# Altium project Biocoin_v1.3.PrjPcb
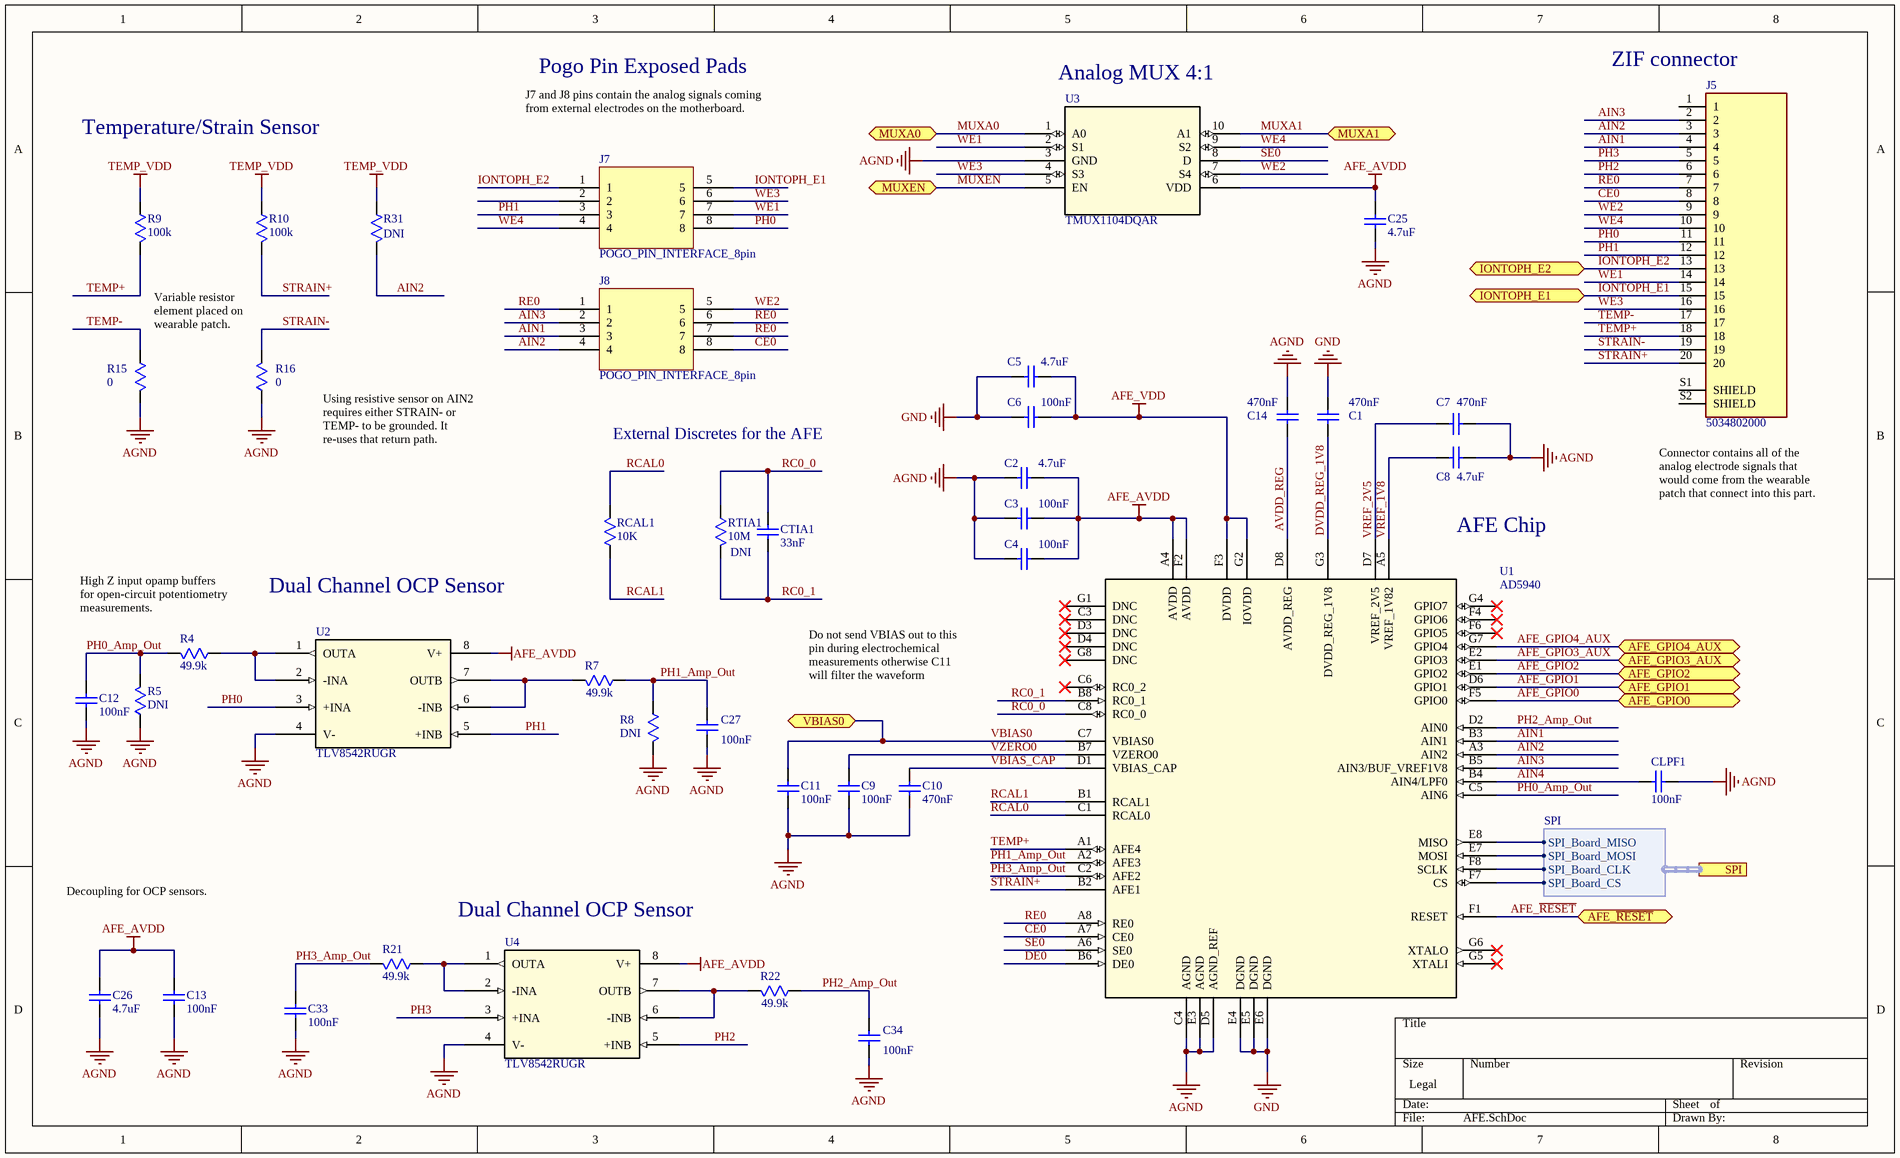
[diagram p0: AFE.SchDoc]
4 sheets, 101 parts. Net scope: flat (ports and power ports of the same name join across sheets).
Board file: Biocoin_v1.3.PcbDoc
Sheets:
  AFE.SchDoc
  MCU_BLE_Module.SchDoc
  Power Management.SchDoc
  Current_Source.SchDoc

## Sheet AFE.SchDoc
size Legal; SheetNumber: 1; SheetTotal: 4

### Parts
C1  value 470nF  [0201 cap]  (hidden comment: CAP)
C2  value 4.7uF  [0201 cap]  (hidden comment: CAP)
C3  value 100nF  [0201 cap]  (hidden comment: CAP)
C4  value 100nF  [0201 cap]  (hidden comment: CAP)
C5  value 4.7uF  [0201 cap]  (hidden comment: CAP)
C6  value 100nF  [0201 cap]  (hidden comment: CAP)
C7  value 470nF  [0201 cap]  (hidden comment: CAP)
C8  value 4.7uF  [0201 cap]  (hidden comment: CAP)
C9  value 100nF  [0402-CAP]  (hidden comment: CAP)
C10  value 470nF  [0201 cap]  (hidden comment: CAP)
C11  value 100nF  [0402-CAP]  (hidden comment: CAP)
C12  value 100nF  [0201 cap]  (hidden comment: CAP)
C13  value 100nF  [0201 cap]  (hidden comment: CAP)
C14  value 470nF  [0201 cap]  (hidden comment: CAP)
C25  value 4.7uF  [0201 cap]  (hidden comment: CAP)
C26  value 4.7uF  [0201 cap]  (hidden comment: CAP)
C27  value 100nF  [0201 cap]  (hidden comment: CAP)
C33  value 100nF  [0201 cap]  (hidden comment: CAP)
C34  value 100nF  [0201 cap]  (hidden comment: CAP)
CLPF1  value 100nF  [0201 cap]  (hidden comment: CAP)
CTIA1  value 33nF  [0402-CAP]  (hidden comment: CAP)
J5  5034802000  [MOLEX_5034802000]
J7  POGO_PIN_INTERFACE_8pin  [POGO_PIN_INTERFACE_8pin]
J8  POGO_PIN_INTERFACE_8pin  [POGO_PIN_INTERFACE_8pin]
R4  value 49.9k  [0201 res]  (hidden comment: RES)
R5  Do Not Install: DNI  [0201 res]  (hidden comment: RES)
R7  value 49.9k  [0201 res]  (hidden comment: RES)
R8  Do Not Install: DNI  [0201 res]  (hidden comment: RES)
R9  value 100k  [0201 res]  (hidden comment: RES)
R10  value 100k  [0201 res]  (hidden comment: RES)
R15  value 0  [0201 res]  (hidden comment: RES)
R16  value 0  [0201 res]  (hidden comment: RES)
R21  value 49.9k  [0201 res]  (hidden comment: RES)
R22  value 49.9k  [0201 res]  (hidden comment: RES)
R31  Do Not Install: DNI  [0201 res]  (hidden comment: RES)
RCAL1  value 10K  [0201 res]  (hidden comment: RES)
RTIA1  value 10M  Do Not Install: DNI  [0402-RES]  (hidden comment: RES)
U1  AD5940  [CB-56-3_ADI]
U2  TLV8542RUGR  [QFN50P150X150X40-8N]
U3  TMUX1104DQAR  [USON_104DQAR_TEX]
U4  TLV8542RUGR  [QFN50P150X150X40-8N]

### Ports
AFE_GPIO0 (bidir), AFE_GPIO1 (bidir), AFE_GPIO2 (bidir), AFE_GPIO3_AUX (bidir), AFE_GPIO4_AUX (bidir), AFE_~{RESET} (bidir), IONTOPH_E1 (bidir), IONTOPH_E2 (bidir), MUXA0 (bidir), MUXA1 (bidir), MUXEN (bidir), SPI (harness SPI), VBIAS0 (bidir)

### Harnesses
SPI: SPI_Board_MISO, SPI_Board_MOSI, SPI_Board_CLK, SPI_Board_CS

### Nets
AFE_AVDD: C2.1 C3.1 C4.1 C13.2 C25.2 C26.2 U1.A4(AVDD) U1.F2(AVDD) U2.8(V+) U3.6(VDD) U4.8(V+)
AFE_VDD: C5.1 C6.1 U1.F3(DVDD) U1.G2(IOVDD)
AGND: C2.2 C3.2 C4.2 C7.1 C8.1 C9.1 C10.1 C11.1 C12.2 C13.1 C14.1 C25.1 C26.1 C27.2 C33.2 C34.2 CLPF1.2 R5.2 R8.2 R15.2 R16.2 U1.C4(AGND) U1.D5(AGND_REF) U1.E3(AGND) U2.4(V-) U3.3(GND) U4.4(V-)
GND: C1.1 C5.2 C6.2 U1.E4(DGND) U1.E5(DGND) U1.E6(DGND)
TEMP_VDD: R9.1 R10.1 R31.1
AFE_GPIO0: U1.F5(GPIO0) ; port AFE_GPIO0
AFE_GPIO1: U1.D6(GPIO1) ; port AFE_GPIO1
AFE_GPIO2: U1.E1(GPIO2) ; port AFE_GPIO2
AFE_GPIO3_AUX: U1.E2(GPIO3) ; port AFE_GPIO3_AUX
AFE_GPIO4_AUX: U1.G7(GPIO4) ; port AFE_GPIO4_AUX
AFE_~{RESET}: U1.F1(RESET) ; port AFE_~{RESET}
AIN1: J5.4 J8.3 U1.B3(AIN1)
AIN2: J5.3 J8.4 R31.2 U1.A3(AIN2)
AIN3: J5.2 J8.2 U1.B5(AIN3/BUF_VREF1V8)
AIN4: CLPF1.1 U1.B4(AIN4/LPF0)
AVDD_REG: C14.2 U1.D8(AVDD_REG)
CE0: J5.8 J8.8 U1.A7(CE0)
DE0: U1.B6(DE0)
DVDD_REG_1V8: C1.2 U1.G3(DVDD_REG_1V8)
IONTOPH_E1: J5.15 J7.5 ; port IONTOPH_E1
IONTOPH_E2: J5.13 J7.1 ; port IONTOPH_E2
MUXA0: U3.1(A0) ; port MUXA0
MUXA1: U3.10(A1) ; port MUXA1
MUXEN: U3.5(EN) ; port MUXEN
PH0: J5.11 J7.8 U2.3(+INA)
PH0_Amp_Out: C12.1 R4.1 R5.1 U1.C5(AIN6)
PH1: J5.12 J7.3 U2.5(+INB)
PH1_Amp_Out: C27.1 R7.1 R8.1 U1.A2(AFE3)
PH2: J5.6 U4.5(+INB)
PH2_Amp_Out: C34.1 R22.1 U1.D2(AIN0)
PH3: J5.5 U4.3(+INA)
PH3_Amp_Out: C33.1 R21.1 U1.C2(AFE2)
RC0_0: CTIA1.1 RTIA1.1 U1.C8(RC0_0)
RC0_1: CTIA1.2 RTIA1.2 U1.B8(RC0_1)
RCAL0: RCAL1.2 U1.C1(RCAL0)
RCAL1: RCAL1.1 U1.B1(RCAL1)
RE0: J5.7 J8.1 J8.6 J8.7 U1.A8(RE0)
SE0: U1.A6(SE0) U3.8(D)
SPI_Board_CLK: U1.F8(SCLK) ; port SPI.SPI_Board_CLK
SPI_Board_CS: U1.F7(CS) ; port SPI.SPI_Board_CS
SPI_Board_MISO: U1.E8(MISO) ; port SPI.SPI_Board_MISO
SPI_Board_MOSI: U1.E7(MOSI) ; port SPI.SPI_Board_MOSI
STRAIN+: J5.20 R10.2 U1.B2(AFE1)
STRAIN-: J5.19 R16.1
TEMP+: J5.18 R9.2 U1.A1(AFE4)
TEMP-: J5.17 R15.1
VBIAS0: C11.2 U1.C7(VBIAS0) ; port VBIAS0
VBIAS_CAP: C10.2 U1.D1(VBIAS_CAP)
VREF_1V8: C8.2 U1.A5(VREF_1V82)
VREF_2V5: C7.2 U1.D7(VREF_2V5)
VZERO0: C9.2 U1.B7(VZERO0)
WE1: J5.14 J7.7 U3.2(S1)
WE2: J5.9 J8.5 U3.7(S4)
WE3: J5.16 J7.6 U3.4(S3)
WE4: J5.10 J7.4 U3.9(S2)
NetR4_2: R4.2 U2.1(OUTA) U2.2(-INA)
NetR7_2: R7.2 U2.6(-INB) U2.7(OUTB)
NetR21_2: R21.2 U4.1(OUTA) U4.2(-INA)
NetR22_2: R22.2 U4.6(-INB) U4.7(OUTB)

Not connected (* = marked no-connect by the designer): J5 1 S1(SHIELD) S2(SHIELD); J7 2; U1 C3(DNC)* C6(RC0_2)* D3(DNC)* D4(DNC)* F4(GPIO6)* F6(GPIO5)* G1(DNC)* G4(GPIO7)* G5(XTALI)* G6(XTALO)* G8(DNC)*

### Notes on the sheet
- Pogo Pin Exposed Pads
- (near U3) Analog MUX 4:1
- (near J5) ZIF connector
- Temperature/Strain Sensor
- J7 and J8 pins contain the analog signals coming from external electrodes on the motherboard.
- Variable resistor element placed on wearable patch.
- Using resistive sensor on AIN2 requires either STRAIN- or TEMP- to be grounded. It re-uses that return path.
- External Discretes for the AFE
- (near J5) Connector contains all of the analog electrode signals that would come from the wearable patch that connect into this part.
- AFE Chip
- (near R4) High Z input opamp buffers for open-circuit potentiometry measurements.
- Dual Channel OCP Sensor
- Do not send VBIAS out to this pin during electrochemical measurements otherwise C11 will filter the waveform
- Decoupling for OCP sensors.

### Library data of the parts
C1-C14 C25-C27 C33 C34 CLPF1 CTIA1 = CAP SMD: Multilayer Chip Capacitor; Designer: OMIGA
J5 = 5034802000: 20 Position FFC, FPC Connector Contacts, Top and Bottom 0.020 (0.50mm) Surface Mount, Right Angle; MP: 503480-2000; MF: Molex; Check_prices: https://www.snapeda.com/parts/503480-2000/Molex/view-part/?ref=eda; Value: *; Availability: In Stock; Price: None; Package: None; SnapEDA_Link: https://www.snapeda.com/parts/503480-2000/Molex/view-part/?ref=snap; Purchase-URL: https://pricing.snapeda.com/search/part/503480-2000/?ref=eda
R4 R5 R7-R10 R15 R16 R21 R22 RTIA1 = RES SMD: Surface Mount Resistor; Designer: OMIGA
R31 = RES SMD: Surface Mount Resistor; Designer: OMIGA; Value: 100k
RCAL1 = RES 0201: Surface Mount Resistor; Designer: OMIGA
U1 = AD5940: High Precision, Impedance, and / Electrochemical Front End
U2 U4 = TLV8542RUGR: Low power, tiny, low input bias current opamp; Mfr_Name: Texas Instruments; RefDes: RefDes; Type: Type
U3 = TMUX1104DQAR_1: No Description Available; Mfr_Name: Texas Instruments; Copyright: Copyright (C) 2022 Ultra Librarian. All rights reserved.; Manufacturer_Part_Number: TMUX1104DQAR; Digi-Key_Part_Number_1: 296-TMUX1104DQARTR-ND; Digi-Key_Part_Number_2: 296-TMUX1104DQARCT-ND; Digi-Key_Part_Number_3: 296-TMUX1104DQARDKR-ND; RefDes: RefDes; Type: DEV

## Sheet MCU_BLE_Module.SchDoc
size Legal; SheetNumber: 2; SheetTotal: 4
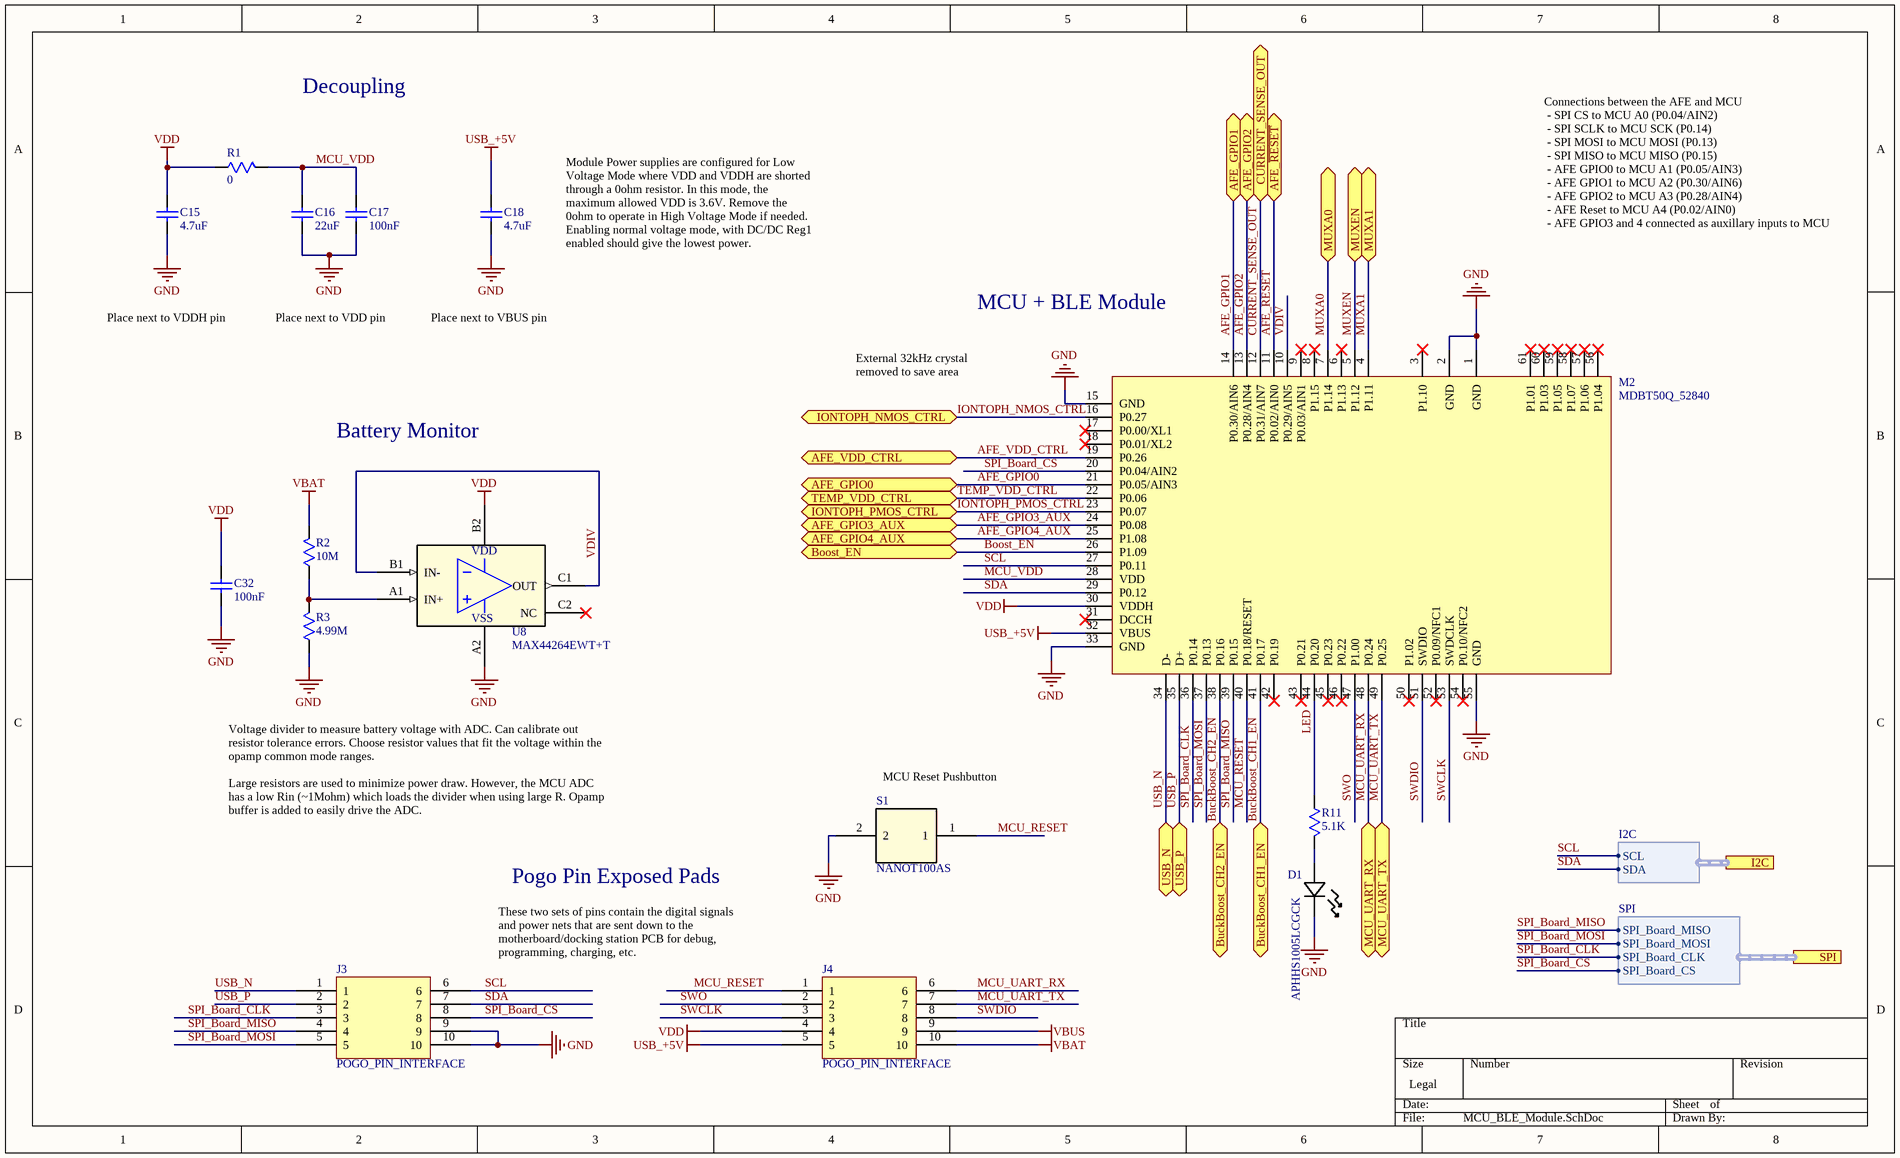
[diagram p1: MCU_BLE_Module.SchDoc]

### Parts
C15  value 4.7uF  [0201 cap]  (hidden comment: CAP)
C16  value 22uF  [0402-CAP]  (hidden comment: CAP)
C17  value 100nF  [0201 cap]  (hidden comment: CAP)
C18  value 4.7uF  [0201 cap]  (hidden comment: CAP)
C32  value 100nF  [0201 cap]  (hidden comment: CAP)
D1  APHHS1005LCGCK  [0402-LED]
J3  POGO_PIN_INTERFACE  [POGO_PIN_INTERFACE_10pin]
J4  POGO_PIN_INTERFACE  [POGO_PIN_INTERFACE_10pin]
M2  MDBT50Q_52840  [MDBT50Q]
R1  value 0  [0201 res]  (hidden comment: RES)
R2  value 10M  [0402-RES]  (hidden comment: RES)
R3  value 4.99M  [0402-RES]  (hidden comment: RES)
R11  value 5.1K  [0201 res]  (hidden comment: RES)
S1  NANOT100AS  [NANOT100AS_CNK-M]
U8  MAX44264EWT+T  [21-0217D_W61B1-1_MXM]

### Ports
AFE_GPIO0 (bidir), AFE_GPIO1 (bidir), AFE_GPIO2 (bidir), AFE_GPIO3_AUX (bidir), AFE_GPIO4_AUX (bidir), AFE_VDD_CTRL (bidir), AFE_~{RESET} (bidir), Boost_EN (bidir), BuckBoost_CH1_EN (bidir), BuckBoost_CH2_EN (bidir), CURRENT_SENSE_OUT (bidir), I2C (harness I2C), IONTOPH_NMOS_CTRL (bidir), IONTOPH_PMOS_CTRL (bidir), MCU_UART_RX (bidir), MCU_UART_TX (bidir), MUXA0 (bidir), MUXA1 (bidir), MUXEN (bidir), SPI (harness SPI), TEMP_VDD_CTRL (bidir), USB_N (bidir), USB_P (bidir)

### Harnesses
SPI: SPI_Board_MISO, SPI_Board_MOSI, SPI_Board_CLK, SPI_Board_CS
I2C: SCL, SDA

### Nets
GND: C15.2 C16.2 C17.2 C18.2 C32.2 D1.1 J3.9 J3.10 M2.1(GND) M2.2(GND) M2.15(GND) M2.33(GND) M2.55(GND) R3.1 S1.2 U8.A2(VSS)
USB_+5V: C18.1 J4.5 M2.32(VBUS)
VBAT: J4.10 R2.2
VBUS: J4.9
VDD: C15.1 C32.1 J4.4 M2.30(VDDH) R1.1 U8.B2(VDD)
AFE_GPIO0: M2.21(P0.05/AIN3) ; port AFE_GPIO0
AFE_GPIO1: M2.14(P0.30/AIN6) ; port AFE_GPIO1
AFE_GPIO2: M2.13(P0.28/AIN4) ; port AFE_GPIO2
AFE_GPIO3_AUX: M2.24(P0.08) ; port AFE_GPIO3_AUX
AFE_GPIO4_AUX: M2.25(P1.08) ; port AFE_GPIO4_AUX
AFE_~{RESET}: M2.11(P0.02/AIN0) ; port AFE_~{RESET}
AFE_VDD_CTRL: M2.19(P0.26) ; port AFE_VDD_CTRL
Boost_EN: M2.26(P1.09) ; port Boost_EN
BuckBoost_CH1_EN: M2.41(P0.17) ; port BuckBoost_CH1_EN
BuckBoost_CH2_EN: M2.38(P0.16) ; port BuckBoost_CH2_EN
CURRENT_SENSE_OUT: M2.12(P0.31/AIN7) ; port CURRENT_SENSE_OUT
IONTOPH_NMOS_CTRL: M2.16(P0.27) ; port IONTOPH_NMOS_CTRL
IONTOPH_PMOS_CTRL: M2.23(P0.07) ; port IONTOPH_PMOS_CTRL
LED: M2.44(P0.20) R11.1
MCU_RESET: J4.1 M2.40(P0.18/RESET) S1.1
MCU_UART_RX: J4.6 M2.48(P0.24) ; port MCU_UART_RX
MCU_UART_TX: J4.7 M2.49(P0.25) ; port MCU_UART_TX
MCU_VDD: C16.1 C17.1 M2.28(VDD) R1.2
MUXA0: M2.7(P1.14) ; port MUXA0
MUXA1: M2.4(P1.11) ; port MUXA1
MUXEN: M2.5(P1.12) ; port MUXEN
SCL: J3.6 M2.27(P0.11) ; port I2C.SCL
SDA: J3.7 M2.29(P0.12) ; port I2C.SDA
SPI_Board_CLK: J3.3 M2.36(P0.14) ; port SPI.SPI_Board_CLK
SPI_Board_CS: J3.8 M2.20(P0.04/AIN2) ; port SPI.SPI_Board_CS
SPI_Board_MISO: J3.4 M2.39(P0.15) ; port SPI.SPI_Board_MISO
SPI_Board_MOSI: J3.5 M2.37(P0.13) ; port SPI.SPI_Board_MOSI
SWCLK: J4.3 M2.53(SWDCLK)
SWDIO: J4.8 M2.51(SWDIO)
SWO: J4.2 M2.47(P1.00)
TEMP_VDD_CTRL: M2.22(P0.06) ; port TEMP_VDD_CTRL
USB_N: J3.1 M2.34(D-) ; port USB_N
USB_P: J3.2 M2.35(D+) ; port USB_P
VDIV: M2.10(P0.29/AIN5) U8.B1(IN-) U8.C1(OUT)
NetD1_2: D1.2 R11.2
NetR2_1: R2.1 R3.2 U8.A1(IN+)

Not connected (* = marked no-connect by the designer): M2 3(P1.10)* 6(P1.13)* 8(P1.15)* 9(P0.03/AIN1)* 17(P0.00/XL1)* 18(P0.01/XL2)* 31(DCCH)* 42(P0.19)* 43(P0.21)* 45(P0.23)* 46(P0.22)* 50(P1.02)* 52(P0.09/NFC1)* 54(P0.10/NFC2)* 56(P1.04)* 57(P1.06)* 58(P1.07)* 59(P1.05)* 60(P1.03)* 61(P1.01)*; U8 C2(NC)*

### Notes on the sheet
- Decoupling
- Connections between the AFE and MCU
  - SPI CS to MCU A0 (P0.04/AIN2)
  - SPI SCLK to MCU SCK (P0.14)
  - SPI MOSI to MCU MOSI (P0.13)
  - SPI MISO to MCU MISO (P0.15)
  - AFE GPIO0 to MCU A1 (P0.05/AIN3)
  - AFE GPIO1 to MCU A2 (P0.30/AIN6)
  - AFE GPIO2 to MCU A3 (P0.28/AIN4)
  - AFE Reset to MCU A4 (P0.02/AIN0)
  - AFE GPIO3 and 4 connected as auxillary inputs to MCU
- Module Power supplies are configured for Low Voltage Mode where VDD and VDDH are shorted through a 0ohm resistor. In this mode, the maximum allowed VDD is 3.6V. Remove the 0ohm to operate in High Voltage Mode if needed. Enabling normal voltage mode, with DC/DC Reg1 enabled should give the lowest power.
- Place next to VDDH pin
- Place next to VDD pin
- Place next to VBUS pin
- MCU + BLE Module
- External 32kHz crystal removed to save area
- Battery Monitor
- Voltage divider to measure battery voltage with ADC. Can calibrate out resistor tolerance errors. Choose resistor values that fit the voltage within the opamp common mode ranges.
  Large resistors are used to minimize power draw. However, the MCU ADC has a low Rin (~1Mohm) which loads the divider when using large R. Opamp buffer is added to easily drive the ADC.
- (near S1) MCU Reset Pushbutton
- Pogo Pin Exposed Pads
- These two sets of pins contain the digital signals and power nets that are sent down to the motherboard/docking station PCB for debug, programming, charging, etc.

### Library data of the parts
C15-C18 C32 = CAP SMD: as C1 on sheet AFE
D1 = APHHS1005LCGCK: Green LED 0402; Mfr_Name: Kingbright; Type: DEV; Copyright: Copyright (C) 2022 Ultra Librarian. All rights reserved.; Manufacturer_Part_Number: APHHS1005LCGCK; RefDes: RefDes
R1-R3 R11 = RES SMD: Surface Mount Resistor; Designer: OMIGA
S1 = NANOT100AS: Smallest Push Button Switch; Mfr_Name: C&K; Copyright: Copyright (C) 2022 Ultra Librarian. All rights reserved.; Manufacturer_Part_Number: NANOT100AS; Digi-Key_Part_Number_1: 108-NANOT100ASTR-ND; Digi-Key_Part_Number_2: 108-NANOT100ASCT-ND; Digi-Key_Part_Number_3: 108-NANOT100ASDKR-ND; RefDes: RefDes; Type: DEV
U8 = MAX44264EWT+T: No Description Available; Mfr_Name: Maxim Integrated Products; Copyright: Copyright (C) 2022 Ultra Librarian. All rights reserved.; Manufacturer_Part_Number: MAX44264EWT+T; RefDes: RefDes; Type: DEV

## Sheet Power Management.SchDoc
size B; SheetNumber: 3; SheetTotal: 4
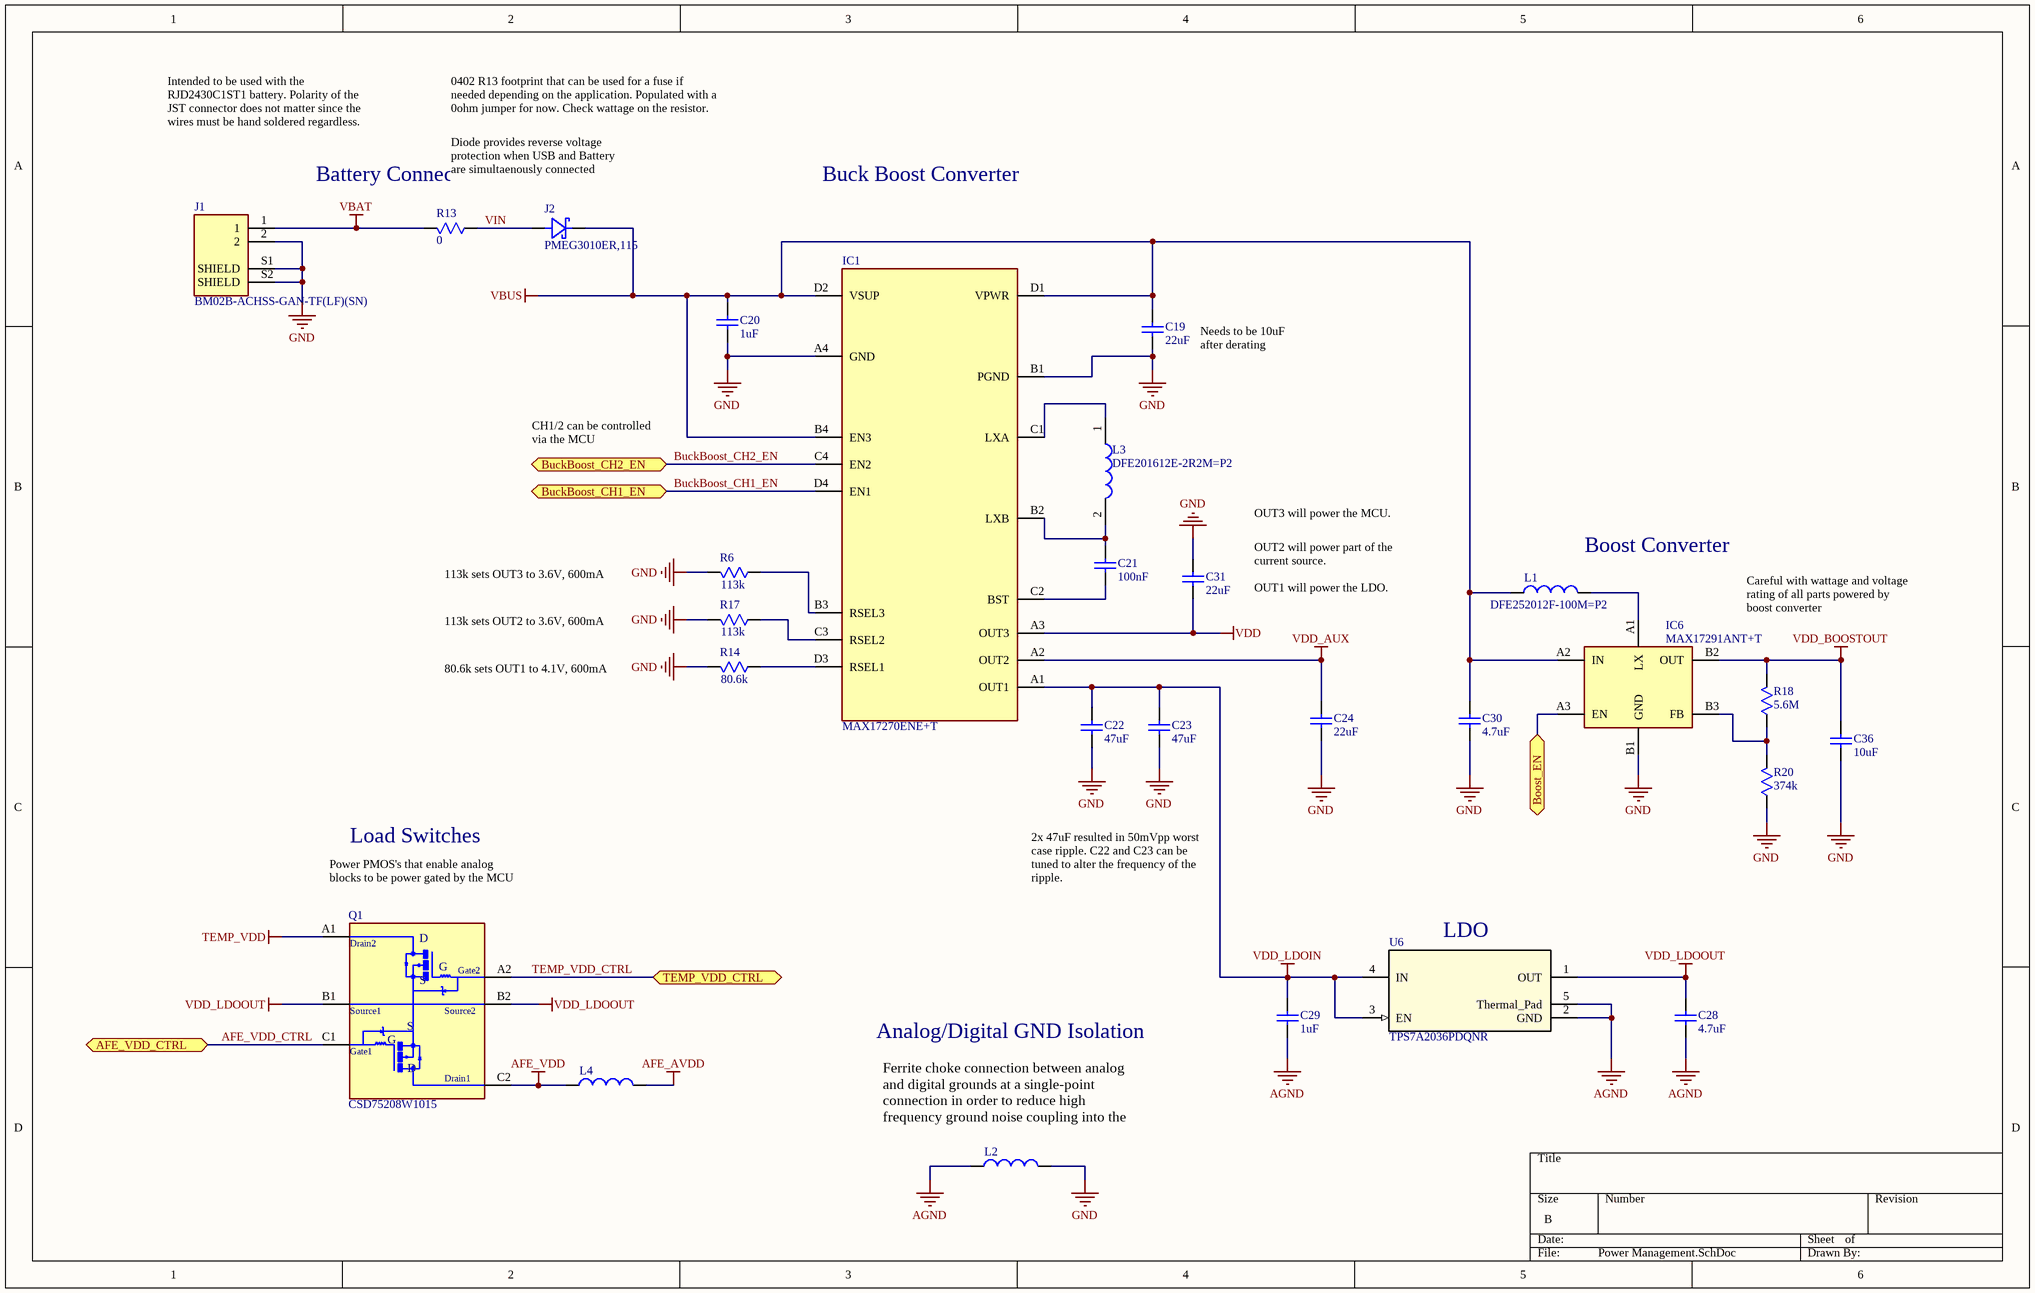
[diagram p2: Power Management.SchDoc]

### Parts
C19  value 22uF  [0402-CAP]  (hidden comment: CAP)
C20  value 1uF  [0201 cap]  (hidden comment: CAP)
C21  value 100nF  [0201 cap]  (hidden comment: CAP)
C22  value 47uF  [0603-CAP]  (hidden comment: CAP)
C23  value 47uF  [0603-CAP]  (hidden comment: CAP)
C24  value 22uF  [0402-CAP]  (hidden comment: CAP)
C28  value 4.7uF  [0201 cap]  (hidden comment: CAP)
C29  value 1uF  [0201 cap]  (hidden comment: CAP)
C30  value 4.7uF  [0201 cap]  (hidden comment: CAP)
C31  value 22uF  [0402-CAP]  (hidden comment: CAP)
C36  value 10uF  [0603-CAP]  (hidden comment: CAP)
IC1  MAX17270ENE+T  [BGA16C40P4X4_177X177X50]
IC6  MAX17291ANT+T  [Maxim_Integrated_N60N1-1_MFG]
J1  BM02B-ACHSS-GAN-TF(LF)(SN)  [JST_BM02B-ACHSS-GAN-TF(LF)(SN)]
J2  PMEG3010ER,115  [SDO_SOD-123FL_ONS-L]
L1  DFE252012F-100M=P2  [INDC2520X120N]
L2  IND  [0201 ferrite]  (value not drawn)
L3  DFE201612E-2R2M=P2  [1286ASH1R0MP2]
L4  IND  [0201 ferrite]  (value not drawn)
Q1  CSD75208W1015  [BGA6C50P2X3_145X95X62]
R6  value 113k  [0201 res]  (hidden comment: RES)
R13  value 0  [0402-RES]  (hidden comment: RES)
R14  value 80.6k  [0201 res]  (hidden comment: RES)
R17  value 113k  [0201 res]  (hidden comment: RES)
R18  value 5.6M  [0201 res]  (hidden comment: RES)
R20  value 374k  [0201 res]  (hidden comment: RES)
U6  TPS7A2036PDQNR  [DQN0004A-MFG]

### Ports
AFE_VDD_CTRL (bidir), Boost_EN (bidir), BuckBoost_CH1_EN (bidir), BuckBoost_CH2_EN (bidir), TEMP_VDD_CTRL (bidir)

### Nets
AFE_AVDD: L4.2
AFE_VDD: L4.1 Q1.C2(DRAIN1)
AGND: C28.2 C29.2 L2.1 U6.2(GND) U6.5(Thermal_Pad)
GND: C19.2 C20.2 C22.2 C23.2 C24.2 C30.2 C31.2 C36.2 IC1.A4(GND) IC1.B1(PGND) IC6.B1(GND) J1.2 J1.S1(SHIELD) J1.S2(SHIELD) L2.2 R6.2 R14.2 R17.2 R20.1
TEMP_VDD: Q1.A1(DRAIN2)
VBAT: J1.1 R13.2
VBUS: C19.1 C20.1 C30.1 IC1.B4(EN3) IC1.D1(VPWR) IC1.D2(VSUP) IC6.A2(IN) J2.1 L1.1
VDD: C31.1 IC1.A3(OUT3)
VDD_AUX: C24.1 IC1.A2(OUT2)
VDD_BOOSTOUT: C36.1 IC6.B2(OUT) R18.2
VDD_LDOIN: C22.1 C23.1 C29.1 IC1.A1(OUT1) U6.3(EN) U6.4(IN)
VDD_LDOOUT: C28.1 Q1.B1(SOURCE1) Q1.B2(SOURCE2) U6.1(OUT)
AFE_VDD_CTRL: Q1.C1(GATE1) ; port AFE_VDD_CTRL
Boost_EN: IC6.A3(EN) ; port Boost_EN
BuckBoost_CH1_EN: IC1.D4(EN1) ; port BuckBoost_CH1_EN
BuckBoost_CH2_EN: IC1.C4(EN2) ; port BuckBoost_CH2_EN
TEMP_VDD_CTRL: Q1.A2(GATE2) ; port TEMP_VDD_CTRL
VIN: J2.2 R13.1
NetC21_1: C21.1 IC1.B2(LXB) L3.2
NetC21_2: C21.2 IC1.C2(BST)
NetIC1_B3: IC1.B3(RSEL3) R6.1
NetIC1_C1: IC1.C1(LXA) L3.1
NetIC1_C3: IC1.C3(RSEL2) R17.1
NetIC1_D3: IC1.D3(RSEL1) R14.1
NetIC6_A1: IC6.A1(LX) L1.2
NetIC6_B3: IC6.B3(FB) R18.1 R20.2

### Notes on the sheet
- Intended to be used with the RJD2430C1ST1 battery. Polarity of the JST connector does not matter since the wires must be hand soldered regardless.
- 0402 R13 footprint that can be used for a fuse if needed depending on the application. Populated with a 0ohm jumper for now. Check wattage on the resistor.
- (near J1) Battery Connector
- Diode provides reverse voltage protection when USB and Battery are simultaenously connected
- Buck Boost Converter
- (near C19) Needs to be 10uF after derating
- CH1/2 can be controlled via the MCU
- OUT3 will power the MCU.
- OUT2 will power part of the current source.
- (near L1) Boost Converter
- 113k sets OUT3 to 3.6V, 600mA limit
- 113k sets OUT2 to 3.6V, 600mA limit
- OUT1 will power the LDO.
- Careful with wattage and voltage rating of all parts powered by boost converter
- 80.6k sets OUT1 to 4.1V, 600mA limit
- (near Q1) Power PMOS's that enable analog blocks to be power gated by the MCU
- Load Switches
- 2x 47uF resulted in 50mVpp worst case ripple. C22 and C23 can be tuned to alter the frequency of the ripple.
- (near U6) LDO
- Analog/Digital GND Isolation
- (near L2) Ferrite choke connection between analog and digital grounds at a single-point connection in order to reduce high frequency ground noise coupling into the AFE.
- (in symbol CSD75208W1015) D; Drain2; G; Gate2; S; Source1; Source2; Gate1; Drain1

### Library data of the parts
C19-C24 C28-C31 C36 = CAP SMD: as C1 on sheet AFE
IC1 = MAX17270ENE+T: nanoPower Triple-Output, Single-Inductor, / Multiple-Output (SIMO) Buck-Boost Regulator; Manufacturer_Name: Maxim Integrated; Datasheet Link: https://pdfserv.maximintegrated.com/en/ds/MAX17270-MAX17271.pdf; Height: 0.5mm; Manufacturer_Part_Number: MAX17270ENE+T
IC6 = MAX17291ANT+T: Integrated Circuit; Manufacturer_Name: Analog Devices; Datasheet Link: https://datasheets.maximintegrated.com/en/ds/MAX17291.pdf; Height: 0.5mm; Manufacturer_Part_Number: MAX17291ANT+T; Mouser Part Number: 700-MAX17291ANT+T; Mouser Price/Stock: https://www.mouser.co.uk/ProductDetail/Maxim-Integrated/MAX17291ANT%2bT?qs=zW32dvEIR3vWkhPvj9WnJw%3D%3D; Arrow Part Number: MAX17291ANT+T; Arrow Price/Stock: https://www.arrow.com/en/products/max17291antt/maxim-integrated?region=nac
J1 = BM02B-ACHSS-GAN-TF(LF)(SN): Connector Header Surface Mount, Right Angle 2 position 0.047 (1.20mm); MF: JST Sales; Value: *; MP: BM02B-ACHSS-GAN-TF(LF)(SN); Package: None; Check_prices: https://www.snapeda.com/parts/BM02B-ACHSS-GAN-TF(LF)(SN)/JST+Sales+America+Inc./view-part/?ref=eda; Price: None; Purchase-URL: https://pricing.snapeda.com/search/part/BM02B-ACHSS-GAN-TF(LF)(SN)/?ref=eda; SnapEDA_Link: https://www.snapeda.com/parts/BM02B-ACHSS-GAN-TF(LF)(SN)/JST+Sales+America+Inc./view-part/?ref=snap; Availability: In Stock
J2 = SCHOTTKY_LowVf
L1 = DFE252012F-100M=P2: Inductor with Inductance: 10uH Tol. +/-20%, Package: 1008 (2520); MF: Murata Electronics; SnapEDA_Link: https://www.snapeda.com/parts/DFE252012F-100M=P2/Murata%20Electronics%20North%20America/view-part/1498782/?ref=snap; Value: *; Digi-Key_Part_Number: 490-13050-1-ND; Mouser-Purchase-URL: https://snapeda.com/shop?store=Mouser&id=1498782; MP: DFE252012F-100M=P2; DigiKey-Purchase-URL: https://snapeda.com/shop?store=DigiKey&id=1498782; Package: 2520 Murata
L2 L4 = IND SMD: Surface Mount Inductor; Designer: OMIGA
L3 = DFE201612E-2R2M=P2: Inductor; Manufacturer_Name: Murata Electronics; Datasheet Link: https://componentsearchengine.com//DFE201612E-2R2M=P2.pdf; Height: 1.2mm; Mouser2 Part Number: 81-DFE201612E-2R2MP2; Mouser2 Price/Stock: https://www.mouser.com/Search/Refine.aspx?Keyword=81-DFE201612E-2R2MP2; Manufacturer_Part_Number: DFE201612E-2R2M=P2
Q1 = CSD75208W1015: -20-V, P channel NexFETâ„¢ power MOSFET, dual Common Source WLP 1 mm x 1.5 mm, 108 mOhm, gate ESD prot; MF: Texas Instruments; SnapEDA_Link: https://www.snapeda.com/parts/CSD75208W1015/Texas+Instruments/view-part/?ref=snap; Price: None; Check_prices: https://www.snapeda.com/parts/CSD75208W1015/Texas+Instruments/view-part/?ref=eda; Value: *; Package: DSBGA-6 Texas Instruments; Availability: In Stock; Purchase-URL: https://pricing.snapeda.com/search/part/CSD75208W1015/?ref=eda; MP: CSD75208W1015
R6 R13 R14 R17 R18 R20 = RES SMD: Surface Mount Resistor; Designer: OMIGA
U6 = TPS7A2036PDQNR: No Description Available; Mfr_Name: Texas Instruments; Type: DEV; RefDes: RefDes; Copyright: Copyright (C) 2022 Ultra Librarian. All rights reserved.; Manufacturer_Part_Number: TPS7A2036PDQNR

## Sheet Current_Source.SchDoc
size A; SheetNumber: 4; SheetTotal: 4
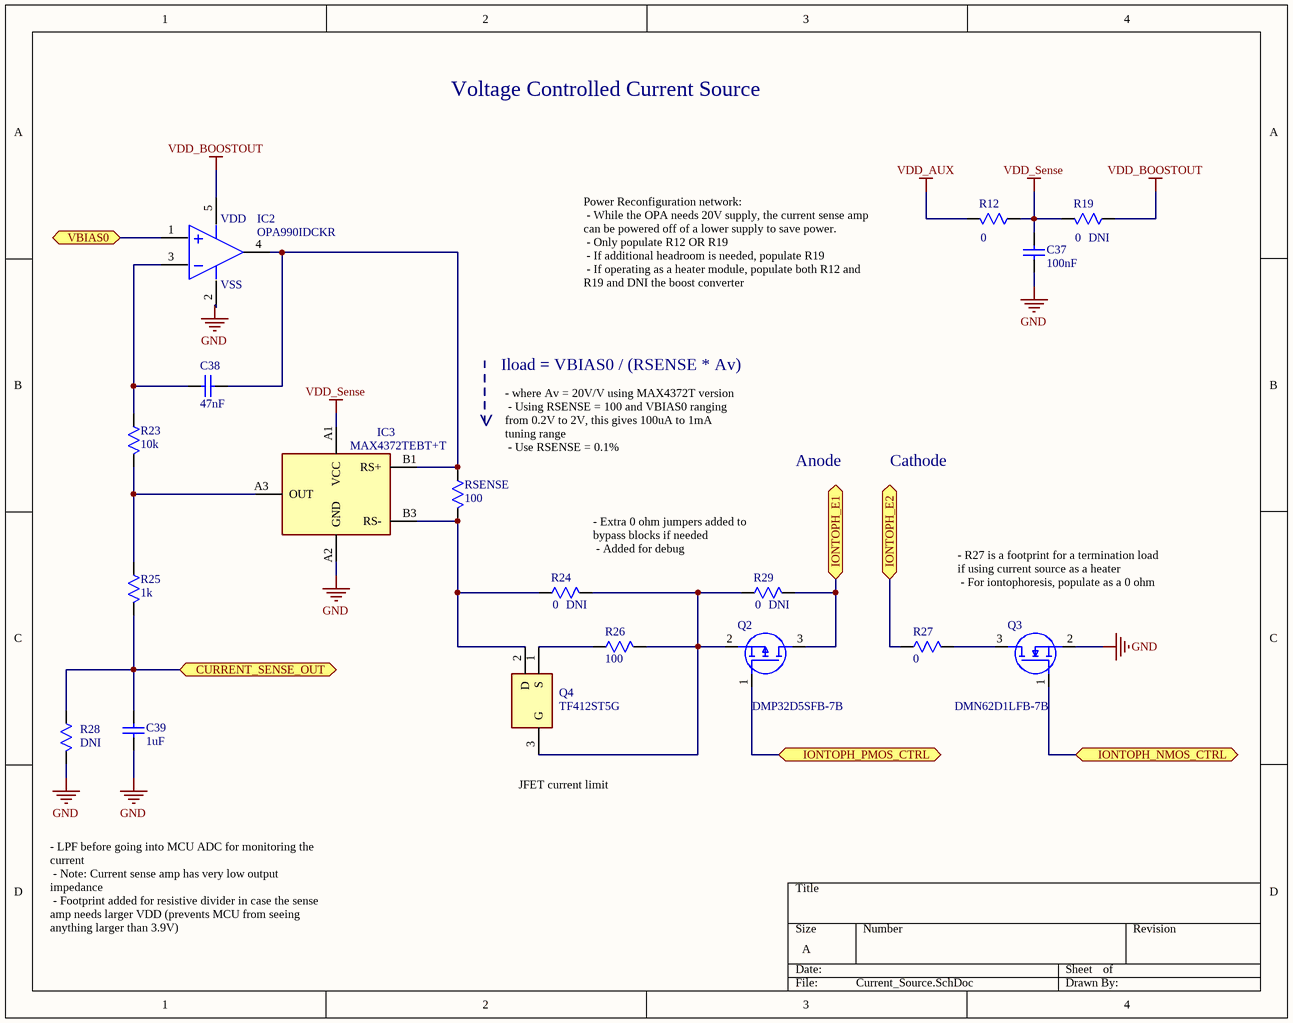
[diagram p3: Current_Source.SchDoc]

### Parts
C37  value 100nF  [0201 cap]  (hidden comment: CAP)
C38  value 47nF  [0201 cap]  (hidden comment: CAP)
C39  value 1uF  [0201 cap]  (hidden comment: CAP)
IC2  OPA990IDCKR  [SOT65P210X110-5N]
IC3  MAX4372TEBT+T  [BGA5C50P3X2_152X100X67]
Q2  DMP32D5SFB-7B  [DESD6V8DLP7]
Q3  DMN62D1LFB-7B  [DESD6V8DLP7]
Q4  TF412ST5G  [TF412ST5G]
R12  value 0  [0201 res]  (hidden comment: RES)
R19  value 0  Do Not Install: DNI  [0201 res]  (hidden comment: RES)
R23  value 10k  [0201 res]  (hidden comment: RES)
R24  value 0  Do Not Install: DNI  [0201 res]  (hidden comment: RES)
R25  value 1k  [0201 res]  (hidden comment: RES)
R26  value 100  [0402-RES]  (hidden comment: RES)
R27  value 0  [0201 res]  (hidden comment: RES)
R28  Do Not Install: DNI  [0201 res]  (hidden comment: RES)
R29  value 0  Do Not Install: DNI  [0201 res]  (hidden comment: RES)
RSENSE  value 100  [0402-RES]  (hidden comment: RES)

### Ports
CURRENT_SENSE_OUT (bidir), IONTOPH_E1 (bidir), IONTOPH_E2 (bidir), IONTOPH_NMOS_CTRL (bidir), IONTOPH_PMOS_CTRL (bidir), VBIAS0 (bidir)

### Nets
GND: C37.1 C39.1 IC2.2(V-) IC3.A2(GND) Q3.2(S) R28.2
VDD_AUX: R12.2
VDD_BOOSTOUT: IC2.5(V+) R19.1
VDD_Sense: C37.2 IC3.A1(VCC) R12.1 R19.2
CURRENT_SENSE_OUT: C39.2 R25.2 R28.1 ; port CURRENT_SENSE_OUT
IONTOPH_E1: Q2.3(D) R29.1 ; port IONTOPH_E1
IONTOPH_E2: R27.1 ; port IONTOPH_E2
IONTOPH_NMOS_CTRL: Q3.1(G) ; port IONTOPH_NMOS_CTRL
IONTOPH_PMOS_CTRL: Q2.1(G) ; port IONTOPH_PMOS_CTRL
VBIAS0: IC2.1(IN+) ; port VBIAS0
NetC38_1: C38.1 IC2.3(IN-) R23.1
NetC38_2: C38.2 IC2.4(OUT) IC3.B1(RS+) RSENSE.1
NetIC3_A3: IC3.A3(OUT) R23.2 R25.1
NetIC3_B3: IC3.B3(RS-) Q4.2(D) R24.2 RSENSE.2
NetQ2_2: Q2.2(S) Q4.3(G) R24.1 R26.2 R29.2
NetQ3_3: Q3.3(D) R27.2
NetQ4_1: Q4.1(S) R26.1

### Notes on the sheet
- Voltage Controlled Current Source
- Power Reconfiguration network:
  - While the OPA needs 20V supply, the current sense amp can be powered off of a lower supply to save power.
  - Only populate R12 OR R19
  - If additional headroom is needed, populate R19
  - If operating as a heater module, populate both R12 and R19 and DNI the boost converter
- Iload = VBIAS0 / (RSENSE * Av)
- >
- |
- (near RSENSE) - where Av = 20V/V using MAX4372T version
  - Using RSENSE = 100 and VBIAS0 ranging from 0.2V to 2V, this gives 100uA to 1mA tuning range
  - Use RSENSE = 0.1%
- Anode
- Cathode
- - Extra 0 ohm jumpers added to bypass blocks if needed
  - Added for debug
- - R27 is a footprint for a termination load if using current source as a heater
  - For iontophoresis, populate as a 0 ohm
- (near Q4) JFET current limit
- - LPF before going into MCU ADC for monitoring the current
  - Note: Current sense amp has very low output impedance
  - Footprint added for resistive divider in case the sense amp needs larger VDD (prevents MCU from seeing anything larger than 3.9V)
- (in symbol OPA990IDCKR) VDD; VSS

### Library data of the parts
C37-C39 = CAP SMD: as C1 on sheet AFE
IC2 = OPA990IDCKR: Integrated Circuit; Manufacturer_Name: Texas Instruments; Datasheet Link: https://www.ti.com/lit/gpn/OPA990; Height: 1.1mm; Manufacturer_Part_Number: OPA990IDCKR; Mouser Part Number: 595-OPA990IDCKR; Mouser Price/Stock: https://www.mouser.co.uk/ProductDetail/Texas-Instruments/OPA990IDCKR?qs=XeJtXLiO41TSF5QBGuARgQ%3D%3D; Arrow Part Number: OPA990IDCKR; Arrow Price/Stock: https://www.arrow.com/en/products/opa990idckr/texas-instruments?region=nac
IC3 = MAX4372TEBT+T: Integrated Circuit; Manufacturer_Name: Analog Devices; Datasheet Link: https://pdfserv.maximintegrated.com/en/ds/MAX4372-MAX4372T.pdf; Height: 0.67mm; Manufacturer_Part_Number: MAX4372TEBT+T; Mouser Part Number: 700-MAX4372TEBT+T; Mouser Price/Stock: https://www.mouser.co.uk/ProductDetail/Maxim-Integrated/MAX4372TEBT%2bT?qs=1eQvB6Dk1vi20izC9qMksw%3D%3D
Q2 = DMP32D5SFB-7B: MOSFET (P-Channel); Manufacturer_Name: Diodes Inc.; Datasheet Link: https://www.diodes.com/assets/Datasheets/DMP32D5SFB.pdf; Height: 0.53mm; Manufacturer_Part_Number: DMP32D5SFB-7B; Mouser Part Number: 621-DMP32D5SFB-7B; Mouser Price/Stock: https://www.mouser.co.uk/ProductDetail/Diodes-Incorporated/DMP32D5SFB-7B?qs=MNIFWdyJgboORiafCqUWHQ%3D%3D; Arrow Part Number: DMP32D5SFB-7B; Arrow Price/Stock: https://www.arrow.com/en/products/dmp32d5sfb-7b/diodes-incorporated
Q3 = DMN62D1LFB-7B: MOSFET (N-Channel); Manufacturer_Name: Diodes Inc.; Datasheet Link: https://www.diodes.com/assets/Datasheets/DMN62D1LFB.pdf; Height: 0.53mm; Manufacturer_Part_Number: DMN62D1LFB-7B; Mouser Part Number: 621-DMN62D1LFB-7B; Mouser Price/Stock: https://www.mouser.co.uk/ProductDetail/Diodes-Incorporated/DMN62D1LFB-7B?qs=y6ZabgHbY%252BxTi2UB8%252BIvCg%3D%3D; Arrow Part Number: DMN62D1LFB-7B; Arrow Price/Stock: https://www.arrow.com/en/products/dmn62d1lfb-7b/diodes-incorporated?region=nac
Q4 = TF412ST5G: N-ch JFET Transistor; Manufacturer_Name: onsemi; Datasheet Link: https://datasheet.datasheetarchive.com/originals/distributors/DKDS-17/338694.pdf; Height: 0.44mm; Manufacturer_Part_Number: TF412ST5G; Mouser Part Number: 863-TF412ST5G; Mouser Price/Stock: https://www.mouser.co.uk/ProductDetail/onsemi/TF412ST5G?qs=k6dkFvHqcvBP99I1DFAJcQ%3D%3D; Arrow Part Number: TF412ST5G; Arrow Price/Stock: https://www.arrow.com/en/products/tf412st5g/on-semiconductor
R12 R19 R23-R29 RSENSE = RES SMD: Surface Mount Resistor; Designer: OMIGA

## Nets that join several sheets
AFE_AVDD: AFE (11 pins), Power Management (L4.2)
AFE_VDD: AFE (C5.1 C6.1 U1.F3 U1.G2), Power Management (L4.1 Q1.C2)
AGND: AFE (27 pins), Power Management (5 pins)
GND: AFE (6 pins), MCU_BLE_Module (16 pins), Power Management (19 pins), Current_Source (6 pins)
TEMP_VDD: AFE (R9.1 R10.1 R31.1), Power Management (Q1.A1)
VBAT: MCU_BLE_Module (J4.10 R2.2), Power Management (J1.1 R13.2)
VBUS: MCU_BLE_Module (J4.9), Power Management (9 pins)
VDD: MCU_BLE_Module (6 pins), Power Management (C31.1 IC1.A3)
VDD_AUX: Power Management (C24.1 IC1.A2), Current_Source (R12.2)
VDD_BOOSTOUT: Power Management (C36.1 IC6.B2 R18.2), Current_Source (IC2.5 R19.1)
AFE_GPIO0: AFE (U1.F5), MCU_BLE_Module (M2.21)
AFE_GPIO1: AFE (U1.D6), MCU_BLE_Module (M2.14)
AFE_GPIO2: AFE (U1.E1), MCU_BLE_Module (M2.13)
AFE_GPIO3_AUX: AFE (U1.E2), MCU_BLE_Module (M2.24)
AFE_GPIO4_AUX: AFE (U1.G7), MCU_BLE_Module (M2.25)
AFE_~{RESET}: AFE (U1.F1), MCU_BLE_Module (M2.11)
AFE_VDD_CTRL: MCU_BLE_Module (M2.19), Power Management (Q1.C1)
Boost_EN: MCU_BLE_Module (M2.26), Power Management (IC6.A3)
BuckBoost_CH1_EN: MCU_BLE_Module (M2.41), Power Management (IC1.D4)
BuckBoost_CH2_EN: MCU_BLE_Module (M2.38), Power Management (IC1.C4)
CURRENT_SENSE_OUT: MCU_BLE_Module (M2.12), Current_Source (C39.2 R25.2 R28.1)
IONTOPH_E1: AFE (J5.15 J7.5), Current_Source (Q2.3 R29.1)
IONTOPH_E2: AFE (J5.13 J7.1), Current_Source (R27.1)
IONTOPH_NMOS_CTRL: MCU_BLE_Module (M2.16), Current_Source (Q3.1)
IONTOPH_PMOS_CTRL: MCU_BLE_Module (M2.23), Current_Source (Q2.1)
MUXA0: AFE (U3.1), MCU_BLE_Module (M2.7)
MUXA1: AFE (U3.10), MCU_BLE_Module (M2.4)
MUXEN: AFE (U3.5), MCU_BLE_Module (M2.5)
SPI_Board_CLK: AFE (U1.F8), MCU_BLE_Module (J3.3 M2.36)
SPI_Board_CS: AFE (U1.F7), MCU_BLE_Module (J3.8 M2.20)
SPI_Board_MISO: AFE (U1.E8), MCU_BLE_Module (J3.4 M2.39)
SPI_Board_MOSI: AFE (U1.E7), MCU_BLE_Module (J3.5 M2.37)
TEMP_VDD_CTRL: MCU_BLE_Module (M2.22), Power Management (Q1.A2)
VBIAS0: AFE (C11.2 U1.C7), Current_Source (IC2.1)